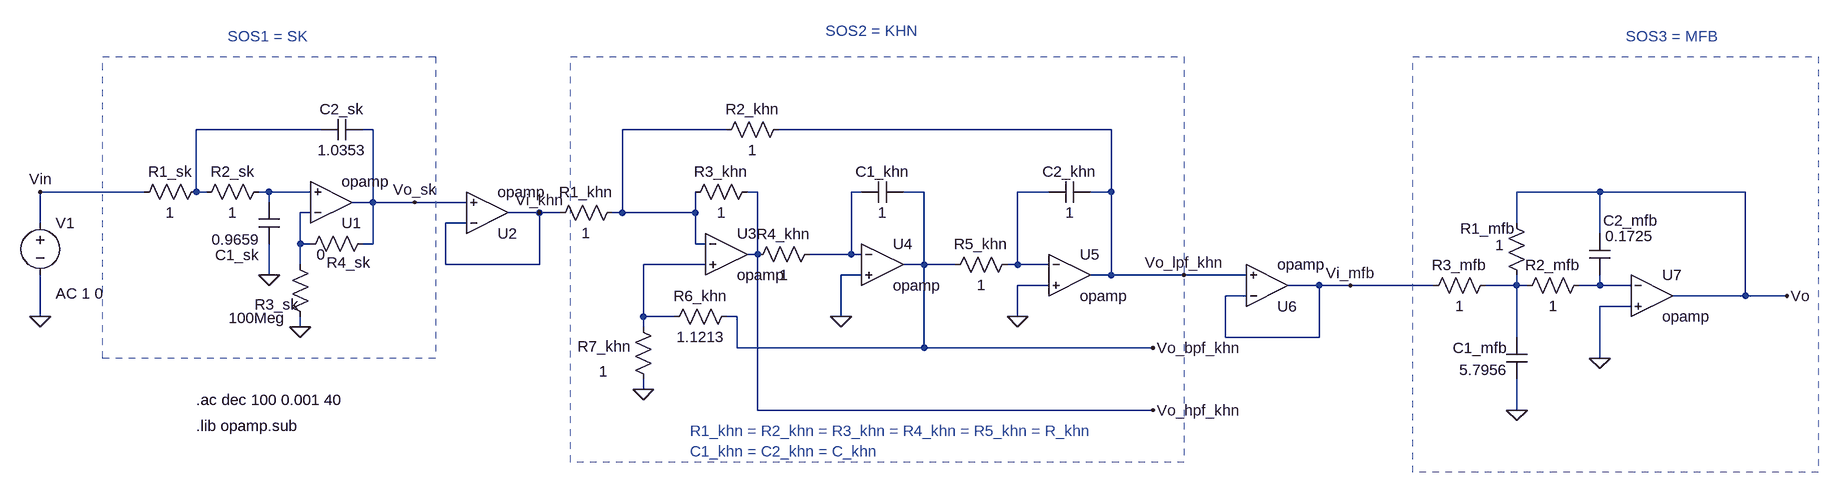
[diagram p0: schematic ts2_butter_n6_desnormalizado.asc]
ts2_butter_n6_desnormalizado.asc, the LTspice schematic file:
Version 4
SHEET 1 2536 760
WIRE 224 112 32 112
WIRE 304 112 288 112
WIRE 848 112 688 112
WIRE 1440 112 928 112
WIRE -48 208 -208 208
WIRE 32 208 32 112
WIRE 48 208 32 208
WIRE 144 208 128 208
WIRE 208 208 144 208
WIRE 896 208 880 208
WIRE 1056 208 1040 208
WIRE 1152 208 1120 208
WIRE 1344 208 1296 208
WIRE 1440 208 1440 112
WIRE 1440 208 1408 208
WIRE 2192 208 2064 208
WIRE 2416 208 2192 208
WIRE 144 224 144 208
WIRE 304 224 304 112
WIRE 304 224 272 224
WIRE 368 224 304 224
WIRE 448 224 368 224
WIRE 208 240 192 240
WIRE 560 240 512 240
WIRE 592 240 560 240
WIRE 688 240 688 112
WIRE 688 240 672 240
WIRE 800 240 800 208
WIRE 800 240 688 240
WIRE -208 256 -208 208
WIRE 448 256 416 256
WIRE 2064 256 2064 208
WIRE 2192 272 2192 208
WIRE 192 288 192 240
WIRE 208 288 192 288
WIRE 304 288 304 224
WIRE 304 288 288 288
WIRE 800 288 800 240
WIRE 816 288 800 288
WIRE 896 304 896 208
WIRE 896 304 880 304
WIRE 1040 304 1040 208
WIRE 1040 304 976 304
WIRE 1056 304 1040 304
WIRE 192 320 192 288
WIRE 416 320 416 256
WIRE 560 320 560 240
WIRE 560 320 416 320
WIRE 816 320 720 320
WIRE 1152 320 1152 208
WIRE 1152 320 1120 320
WIRE 1200 320 1152 320
WIRE 1296 320 1296 208
WIRE 1296 320 1280 320
WIRE 1344 320 1296 320
WIRE 144 336 144 288
WIRE 1056 336 1024 336
WIRE 1440 336 1440 208
WIRE 1440 336 1408 336
WIRE 1552 336 1440 336
WIRE 1648 336 1552 336
WIRE 1344 352 1296 352
WIRE 1760 352 1712 352
WIRE 1808 352 1760 352
WIRE 1936 352 1808 352
WIRE 2064 352 2064 336
WIRE 2064 352 2016 352
WIRE 2080 352 2064 352
WIRE 2192 352 2192 336
WIRE 2192 352 2160 352
WIRE 2240 352 2192 352
WIRE 1648 368 1616 368
WIRE 2416 368 2416 208
WIRE 2416 368 2304 368
WIRE 2480 368 2416 368
WIRE 2240 384 2192 384
WIRE -208 400 -208 336
WIRE 720 400 720 320
WIRE 768 400 720 400
WIRE 864 400 848 400
WIRE 1024 400 1024 336
WIRE 1296 400 1296 352
WIRE 192 416 192 400
WIRE 720 416 720 400
WIRE 1616 432 1616 368
WIRE 1760 432 1760 352
WIRE 1760 432 1616 432
WIRE 2064 432 2064 352
WIRE 864 448 864 400
WIRE 1152 448 1152 320
WIRE 1152 448 864 448
WIRE 1504 448 1152 448
WIRE 2192 464 2192 384
WIRE 720 512 720 496
WIRE 896 544 896 304
WIRE 1504 544 896 544
WIRE 2064 544 2064 496
FLAG 144 336 0
FLAG 720 512 0
FLAG 1024 400 0
FLAG 1296 400 0
FLAG 2064 544 0
FLAG 2192 464 0
FLAG -208 400 0
FLAG -208 208 Vin
FLAG 368 224 Vo_sk
FLAG 1552 336 Vo_lpf_khn
FLAG 2480 368 Vo
FLAG 1504 448 Vo_bpf_khn
FLAG 1504 544 Vo_hpf_khn
FLAG 192 416 0
FLAG 560 240 Vi_khn
FLAG 1808 352 Vi_mfb
SYMBOL res 48 192 R90
WINDOW 0 0 56 VBottom 2
WINDOW 3 32 56 VTop 2
SYMATTR InstName R1_sk
SYMATTR Value 1
SYMBOL res 144 192 R90
WINDOW 0 0 56 VBottom 2
WINDOW 3 32 56 VTop 2
SYMATTR InstName R2_sk
SYMATTR Value 1
SYMBOL cap 128 224 R0
WINDOW 3 -72 57 Left 2
WINDOW 0 -67 81 Left 2
SYMATTR Value 0.9659
SYMATTR InstName C1_sk
SYMBOL cap 288 96 R90
WINDOW 0 0 32 VBottom 2
WINDOW 3 32 32 VTop 2
SYMATTR InstName C2_sk
SYMATTR Value 1.0353
SYMBOL Opamps\\opamp 480 304 M180
SYMATTR InstName U2
SYMBOL Opamps\\opamp 1088 256 R0
SYMATTR InstName U4
SYMBOL Opamps\\opamp 1376 272 R0
SYMATTR InstName U5
SYMBOL res 704 400 R0
WINDOW 0 -85 46 Left 2
WINDOW 3 -52 84 Left 2
SYMATTR InstName R7_khn
SYMATTR Value 1
SYMBOL res 864 384 R90
WINDOW 0 0 56 VBottom 2
WINDOW 3 32 56 VTop 2
SYMATTR InstName R6_khn
SYMATTR Value 1.1213
SYMBOL res 992 288 R90
WINDOW 0 0 56 VBottom 2
WINDOW 3 32 56 VTop 2
SYMATTR InstName R4_khn
SYMATTR Value 1
SYMBOL res 1296 304 R90
WINDOW 0 0 56 VBottom 2
WINDOW 3 32 56 VTop 2
SYMATTR InstName R5_khn
SYMATTR Value 1
SYMBOL res 896 192 R90
WINDOW 0 0 56 VBottom 2
WINDOW 3 32 56 VTop 2
SYMATTR InstName R3_khn
SYMATTR Value 1
SYMBOL res 688 224 R90
WINDOW 0 0 56 VBottom 2
WINDOW 3 32 56 VTop 2
SYMATTR InstName R1_khn
SYMATTR Value 1
SYMBOL res 944 96 R90
WINDOW 0 0 56 VBottom 2
WINDOW 3 32 56 VTop 2
SYMATTR InstName R2_khn
SYMATTR Value 1
SYMBOL cap 1120 192 R90
WINDOW 0 0 32 VBottom 2
WINDOW 3 32 32 VTop 2
SYMATTR InstName C1_khn
SYMATTR Value 1
SYMBOL cap 1408 192 R90
WINDOW 0 0 32 VBottom 2
WINDOW 3 32 32 VTop 2
SYMATTR InstName C2_khn
SYMATTR Value 1
SYMBOL Opamps\\opamp 848 240 R0
SYMATTR InstName U3
SYMBOL Opamps\\opamp 1680 416 M180
SYMATTR InstName U6
SYMBOL Opamps\\opamp 2272 304 R0
SYMATTR InstName U7
SYMBOL cap 2176 272 R0
WINDOW 0 21 -20 Left 2
WINDOW 3 24 4 Left 2
SYMATTR InstName C2_mfb
SYMATTR Value 0.1725
SYMBOL res 2048 240 R0
WINDOW 0 -71 24 Left 2
WINDOW 3 -17 50 Left 2
SYMATTR InstName R1_mfb
SYMATTR Value 1
SYMBOL res 2032 336 R90
WINDOW 0 0 56 VBottom 2
WINDOW 3 32 56 VTop 2
SYMATTR InstName R3_mfb
SYMATTR Value 1
SYMBOL res 2176 336 R90
WINDOW 0 0 56 VBottom 2
WINDOW 3 32 56 VTop 2
SYMATTR InstName R2_mfb
SYMATTR Value 1
SYMBOL voltage -208 240 R0
WINDOW 123 24 124 Left 2
WINDOW 39 0 0 Left 0
WINDOW 3 24 44 Left 2
SYMATTR Value2 AC 1 0
SYMATTR Value ""
SYMATTR InstName V1
SYMBOL cap 2048 432 R0
WINDOW 0 -82 16 Left 2
WINDOW 3 -72 50 Left 2
SYMATTR InstName C1_mfb
SYMATTR Value 5.7956
SYMBOL res 176 304 R0
WINDOW 0 -54 77 Left 2
WINDOW 3 -94 98 Left 2
SYMATTR InstName R3_sk
SYMATTR Value 100Meg
SYMBOL res 304 272 R90
WINDOW 0 60 37 VBottom 2
WINDOW 3 17 80 VTop 2
SYMATTR InstName R4_sk
SYMATTR Value 0
SYMBOL Opamps\\opamp 240 288 M180
SYMATTR InstName U1
TEXT 32 568 Left 2 !.lib opamp.sub
TEXT 32 528 Left 2 !.ac dec 100 0.001 40
TEXT 792 576 Left 2 ;R1_khn = R2_khn = R3_khn = R4_khn = R5_khn = R_khn\nC1_khn = C2_khn = C_khn
TEXT 80 -32 Left 2 ;SOS1 = SK
TEXT 1000 -40 Left 2 ;SOS2 = KHN
TEXT 2232 -32 Left 2 ;SOS3 = MFB
RECTANGLE Normal 400 464 -112 0 2
RECTANGLE Normal 1552 624 608 0 2
RECTANGLE Normal 2528 640 1904 0 2

The netlist it stands for:
* ts2_butter_n6_desnormalizado.asc
R1_sk N001 Vin 1
R2_sk N003 N001 1
C1_sk N003 0 0.9659
C2_sk Vo_sk N001 1.0353
XU2 Vi_khn Vo_sk Vi_khn opamp Aol=100K GBW=10Meg  ; pins invin noninvin out
XU4 N004 0 Vo_bpf_khn opamp Aol=100K GBW=10Meg  ; pins invin noninvin out
XU5 N005 0 Vo_lpf_khn opamp Aol=100K GBW=10Meg  ; pins invin noninvin out
R7_khn N007 0 1
R6_khn Vo_bpf_khn N007 1.1213
R4_khn N004 Vo_hpf_khn 1
R5_khn N005 Vo_bpf_khn 1
R3_khn Vo_hpf_khn N002 1
R1_khn N002 Vi_khn 1
R2_khn Vo_lpf_khn N002 1
C1_khn Vo_bpf_khn N004 1
C2_khn Vo_lpf_khn N005 1
XU3 N002 N007 Vo_hpf_khn opamp Aol=100K GBW=10Meg  ; pins invin noninvin out
XU6 Vi_mfb Vo_lpf_khn Vi_mfb opamp Aol=100K GBW=10Meg  ; pins invin noninvin out
XU7 N009 0 Vo opamp Aol=100K GBW=10Meg  ; pins invin noninvin out
C2_mfb Vo N009 0.1725
R1_mfb Vo N008 1
R3_mfb N008 Vi_mfb 1
R2_mfb N009 N008 1
V1 Vin 0 AC 1 0
C1_mfb N008 0 5.7956
R3_sk N006 0 100Meg
R4_sk Vo_sk N006 0
XU1 N006 N003 Vo_sk opamp Aol=100K GBW=10Meg  ; pins invin noninvin out
.lib opamp.sub
.ac dec 100 0.001 40
* R1_khn = R2_khn = R3_khn = R4_khn = R5_khn = R_khn
* C1_khn = C2_khn = C_khn
* SOS1 = SK
* SOS2 = KHN
* SOS3 = MFB
.backanno
.end